# Altium schematic sheet 电机.SchDoc
size A4
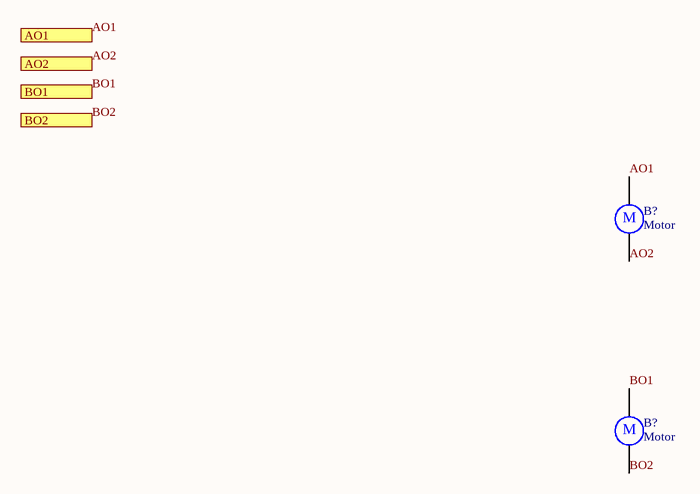
[diagram p0: 电机.SchDoc]

## Parts
(Parts that share a designator on the sheet are numbered #1, #2 ... from top to bottom, then left to right.)
B?#1  Motor  [RB5-10.5]
B?#2  Motor  [RB5-10.5]

## Ports
AO1, AO2, BO1, BO2

## Nets
AO1: B?#1.1 ; port AO1
AO2: B?#1.2 ; port AO2
BO1: B?#2.1 ; port BO1
BO2: B?#2.2 ; port BO2

## Notes on the sheet
- (in symbol Motor) M

## Library data of the parts
B?#1 B?#2 = Motor: Motor, General Kind; Published: 24-Mar-1999; LatestRevisionDate: 17-Jul-2002; LatestRevisionNote: Re-released for DXP Platform.; PackageReference: RB5-10.5; Publisher: Altium Limited; PackageDescription: Capacitor (Radial); 2 Leads